# Altium schematic sheet pull_up_pull_down_switch.SchDoc
size A4; Engineer: Amir Hossein Jobeiri; Organization: Simaran; SheetNumber: 11; SheetTotal: 24
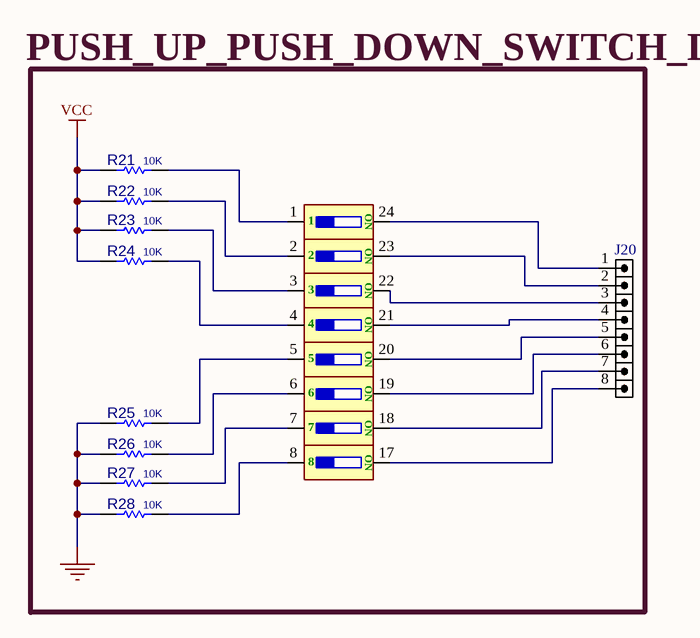
[diagram p0: pull_up_pull_down_switch.SchDoc]

## Parts
J20  HDR1X8  [HDR_M_1X8]  (value not drawn)
R21  10K  [R025W_AX04]
R22  10K  [R025W_AX04]
R23  10K  [R025W_AX04]
R24  10K  [R025W_AX04]
R25  10K  [R025W_AX04]
R26  10K  [R025W_AX04]
R27  10K  [R025W_AX04]
R28  10K  [R025W_AX04]
S2  DIPSW12  [DIPSW254T_12]  (value not drawn)  (parts A,B,C,D,E,F,G,H of 12)

## Nets
GND: R25.2 R26.2 R27.2 R28.2
VCC: R21.2 R22.2 R23.2 R24.2
NetJ20_1: J20.1 S2.24(B1)
NetJ20_2: J20.2 S2.23(B2)
NetJ20_3: J20.3 S2.22(B3)
NetJ20_4: J20.4 S2.21(B4)
NetJ20_5: J20.5 S2.20(B5)
NetJ20_6: J20.6 S2.19(B6)
NetJ20_7: J20.7 S2.18(B7)
NetJ20_8: J20.8 S2.17(B8)
NetR21_1: R21.1 S2.1(A1)
NetR22_1: R22.1 S2.2(A2)
NetR23_1: R23.1 S2.3(A3)
NetR24_1: R24.1 S2.4(A4)
NetR25_1: R25.1 S2.5(A5)
NetR26_1: R26.1 S2.6(A6)
NetR27_1: R27.1 S2.7(A7)
NetR28_1: R28.1 S2.8(A8)

## Notes on the sheet
- PUSH_UP_PUSH_DOWN_SWITCH_DONE
- (in symbol DIPSW254T_12P, part A) ON
- (in symbol DIPSW254T_12P, part B) ON
- (in symbol DIPSW254T_12P, part C) ON
- (in symbol DIPSW254T_12P, part D) ON
- (in symbol DIPSW254T_12P, part E) ON
- (in symbol DIPSW254T_12P, part F) ON
- (in symbol DIPSW254T_12P, part G) ON
- (in symbol DIPSW254T_12P, part H) ON

## Library data of the parts
J20 = HDR_M_1X8: CONN, HEADER, Male, pitch: 2.54mm, 8POS; VALUE: HDRM8
R21-R28 = RES_THD: RESISTOR, THD; MANF_P#: RK73H1ETTP4701F; MANF: KOA SPEER; PARAM: 0.063W; DESC: DESCRIPTION; DIST#: MOUSER; PARAM2: 1%; ASSEMBLY: ASSEMBLY; PRICE: 100= 0.5$; VALUE: 10K
S2 = DIPSW254T_12P: SWITCH, DIP, 12P, THD; MANF: MANF; MANF_P#: MANF_P#; VALUE: DIPSW12